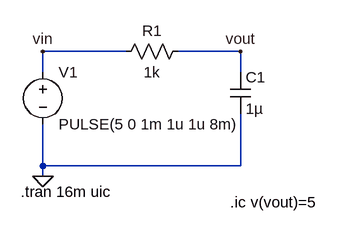
[diagram p0: schematic RC3revisit1.asc]
RC3revisit1.asc, the LTspice schematic file:
Version 4
SHEET 1 880 680
WIRE 160 112 32 112
WIRE 336 112 240 112
WIRE 32 144 32 112
WIRE 336 144 336 112
WIRE 32 288 32 224
WIRE 336 288 336 208
WIRE 336 288 32 288
WIRE 32 304 32 288
FLAG 32 304 0
FLAG 32 112 vin
FLAG 336 112 vout
SYMBOL res 256 96 R90
WINDOW 0 0 56 VBottom 2
WINDOW 3 32 56 VTop 2
SYMATTR InstName R1
SYMATTR Value 1k
SYMBOL voltage 32 128 R0
WINDOW 123 0 0 Left 0
WINDOW 39 0 0 Left 0
SYMATTR InstName V1
SYMATTR Value PULSE(5 0 1m 1u 1u 8m)
SYMBOL cap 320 144 R0
SYMATTR InstName C1
SYMATTR Value 1µ
TEXT -2 328 Left 2 !.tran 16m uic
TEXT 320 344 Left 2 !.ic v(vout)=5

The netlist it stands for:
* RC3revisit1.asc
R1 vout vin 1k
V1 vin 0 PULSE(5 0 1m 1u 1u 8m)
C1 vout 0 1µ
.tran 16m uic
.ic v(vout)=5
.backanno
.end